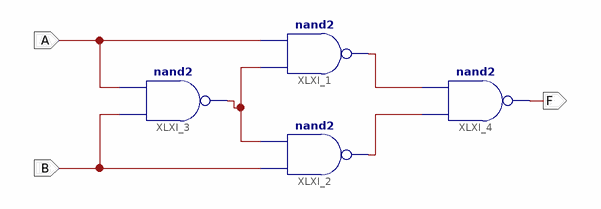
[diagram p0: schematic sheet 1]
// Xilinx ISE schematic Exor_Using_Nand.sch (spartan3e) as structural Verilog: 4 symbols, 3 ports
module Exor_Using_Nand (
  input  A,
  input  B,
  output F
);

  wire XLXN_1, XLXN_5, XLXN_6;

  nand XLXI_1 (XLXN_5, XLXN_1, A);
  nand XLXI_2 (XLXN_6, B, XLXN_1);
  nand XLXI_3 (XLXN_1, B, A);
  nand XLXI_4 (F, XLXN_6, XLXN_5);
endmodule
